# EAGLE schematic dimmer (EAGLE 8.6.3)
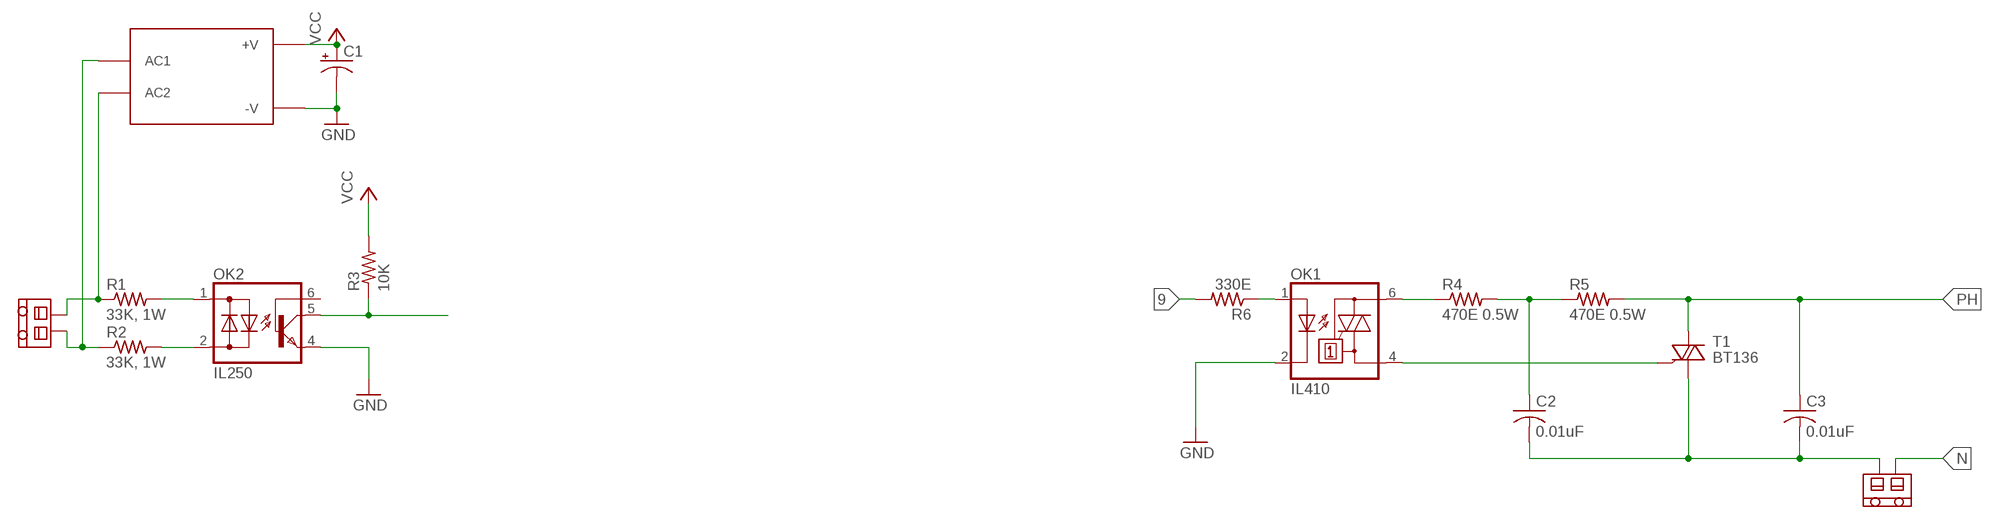
[diagram p0: schematic, sheet 1]

## Parts
C1  CPOL-US153CLV-0807  [153CLV-0807]
C2  0.01uF  C-US075-032X103  [C075-032X103]
C3  0.01uF  C-US075-032X103  [C075-032X103]
OK1  IL410  [DIL06]
OK2  IL250  [DIL06]
R1  33K, 1W  R-US_0207/10  [0207/10]
R2  33K, 1W  R-US_0207/10  [0207/10]
R3  10K  R-US_M0805  [M0805]
R4  470E 0.5W  R-US_0207/12  [0207/12]
R5  470E 0.5W  R-US_0207/12  [0207/12]
R6  330E  R-US_M1206  [M1206]
T1  BT136  [TO220AB]
U$1  DC_ADAPTER  [DC_ADAPTER]
U$2  TERMINAL_BLOCK  [TERMINAL_BLOCK]
U$3  TERMINAL_BLOCK  [TERMINAL_BLOCK]

## Nets
9: R6.2
GND: C1.- OK1.2(C) OK2.4(E) U$1.V-(-V)
N: R2.1 U$1.AC1 U$2.1 U$3.1
N$1: OK2.1(AC1) R1.2
N$2: OK1.1(A) R6.1
N$4: OK2.2(AC2) R2.2
N$5: OK2.5(C) R3.1
N$6: OK1.6(A2) R4.1
N$7: C2.1 R4.2 R5.1
N$8: C2.2 C3.2 T1.1(A1) U$3.2
N$9: OK1.4(A1) T1.3(G)
PH: C3.1 R1.1 R5.2 T1.2(A2) U$1.AC2 U$2.2
VCC: C1.+ R3.2 U$1.V+(+V)
Unconnected: OK2.6(B)

## Library data of the parts
C1 = rcl:CPOL-US: POLARIZED CAPACITOR, American symbol; SPICEPREFIX: C
C2 C3 = rcl:C-US: CAPACITOR, American symbol; SPICEPREFIX: C
OK1 = optocoupler:IL410: SIEMENS OPTO COUPLER; MF: VISHAY/TELEFUNKEN; MPN: IL410; OC_FARNELL: 1045434; OC_NEWARK: 58K1715
OK2 = optocoupler:IL250: SIEMENS OPTO COUPLER; MF: VISHAY/TELEFUNKEN; MPN: IL250; OC_FARNELL: 1469559; OC_NEWARK: 58K1705
R1-R6 = rcl:R-US_: RESISTOR, American symbol; SPICEPREFIX: R
T1 = triac:BT136: Triac BT136 series E sensitive gate Source: http://www.nxp.com/acrobat_download/datasheets/BT136_SERIES_E_2.pdf
U$1 = dragCustom:DC_ADAPTER
U$2 U$3 = dragCustom:TERMINAL_BLOCK